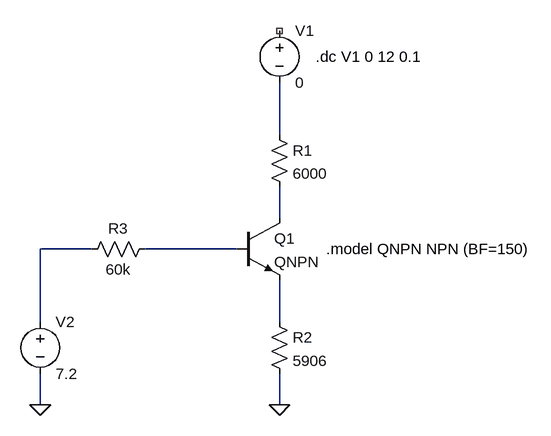
[diagram p0: schematic Simulation 2.asc]
Simulation 2.asc, the LTspice schematic file:
Version 4.1
SHEET 1 880 712
WIRE 176 256 176 176
WIRE 176 384 176 336
WIRE -112 432 -192 432
WIRE 112 432 -32 432
WIRE -192 544 -192 432
WIRE 176 544 176 480
WIRE -192 672 -192 624
WIRE 176 672 176 624
FLAG -192 672 0
FLAG 176 672 0
SYMBOL voltage 176 80 R0
WINDOW 123 0 0 Left 0
WINDOW 39 0 0 Left 0
SYMATTR InstName V1
SYMATTR Value 0
SYMBOL res 160 240 R0
SYMATTR InstName R1
SYMATTR Value 6000
SYMBOL npn 112 384 R0
SYMATTR InstName Q1
SYMATTR Value QNPN
SYMBOL res 160 528 R0
SYMATTR InstName R2
SYMATTR Value 5906
SYMBOL res -16 416 R90
WINDOW 0 0 56 VBottom 2
WINDOW 3 32 56 VTop 2
SYMATTR InstName R3
SYMATTR Value 60k
SYMBOL voltage -192 528 R0
WINDOW 123 0 0 Left 0
WINDOW 39 0 0 Left 0
SYMATTR InstName V2
SYMATTR Value 7.2
TEXT 248 432 Left 2 !.model QNPN NPN (BF=150)
TEXT 232 136 Left 2 !.dc V1 0 12 0.1

The netlist it stands for:
* Simulation 2.asc
V1 NC_01 N001 0
R1 N001 N002 6000
Q1 N002 N004 N005 0 QNPN
R2 N005 0 5906
R3 N004 N003 60k
V2 N003 0 7.2
.model NPN NPN
.model PNP PNP
.lib standard.bjt
.model QNPN NPN (BF=150)
.dc V1 0 12 0.1
.backanno
.end